# EAGLE schematic Nixie (EAGLE 6.3)
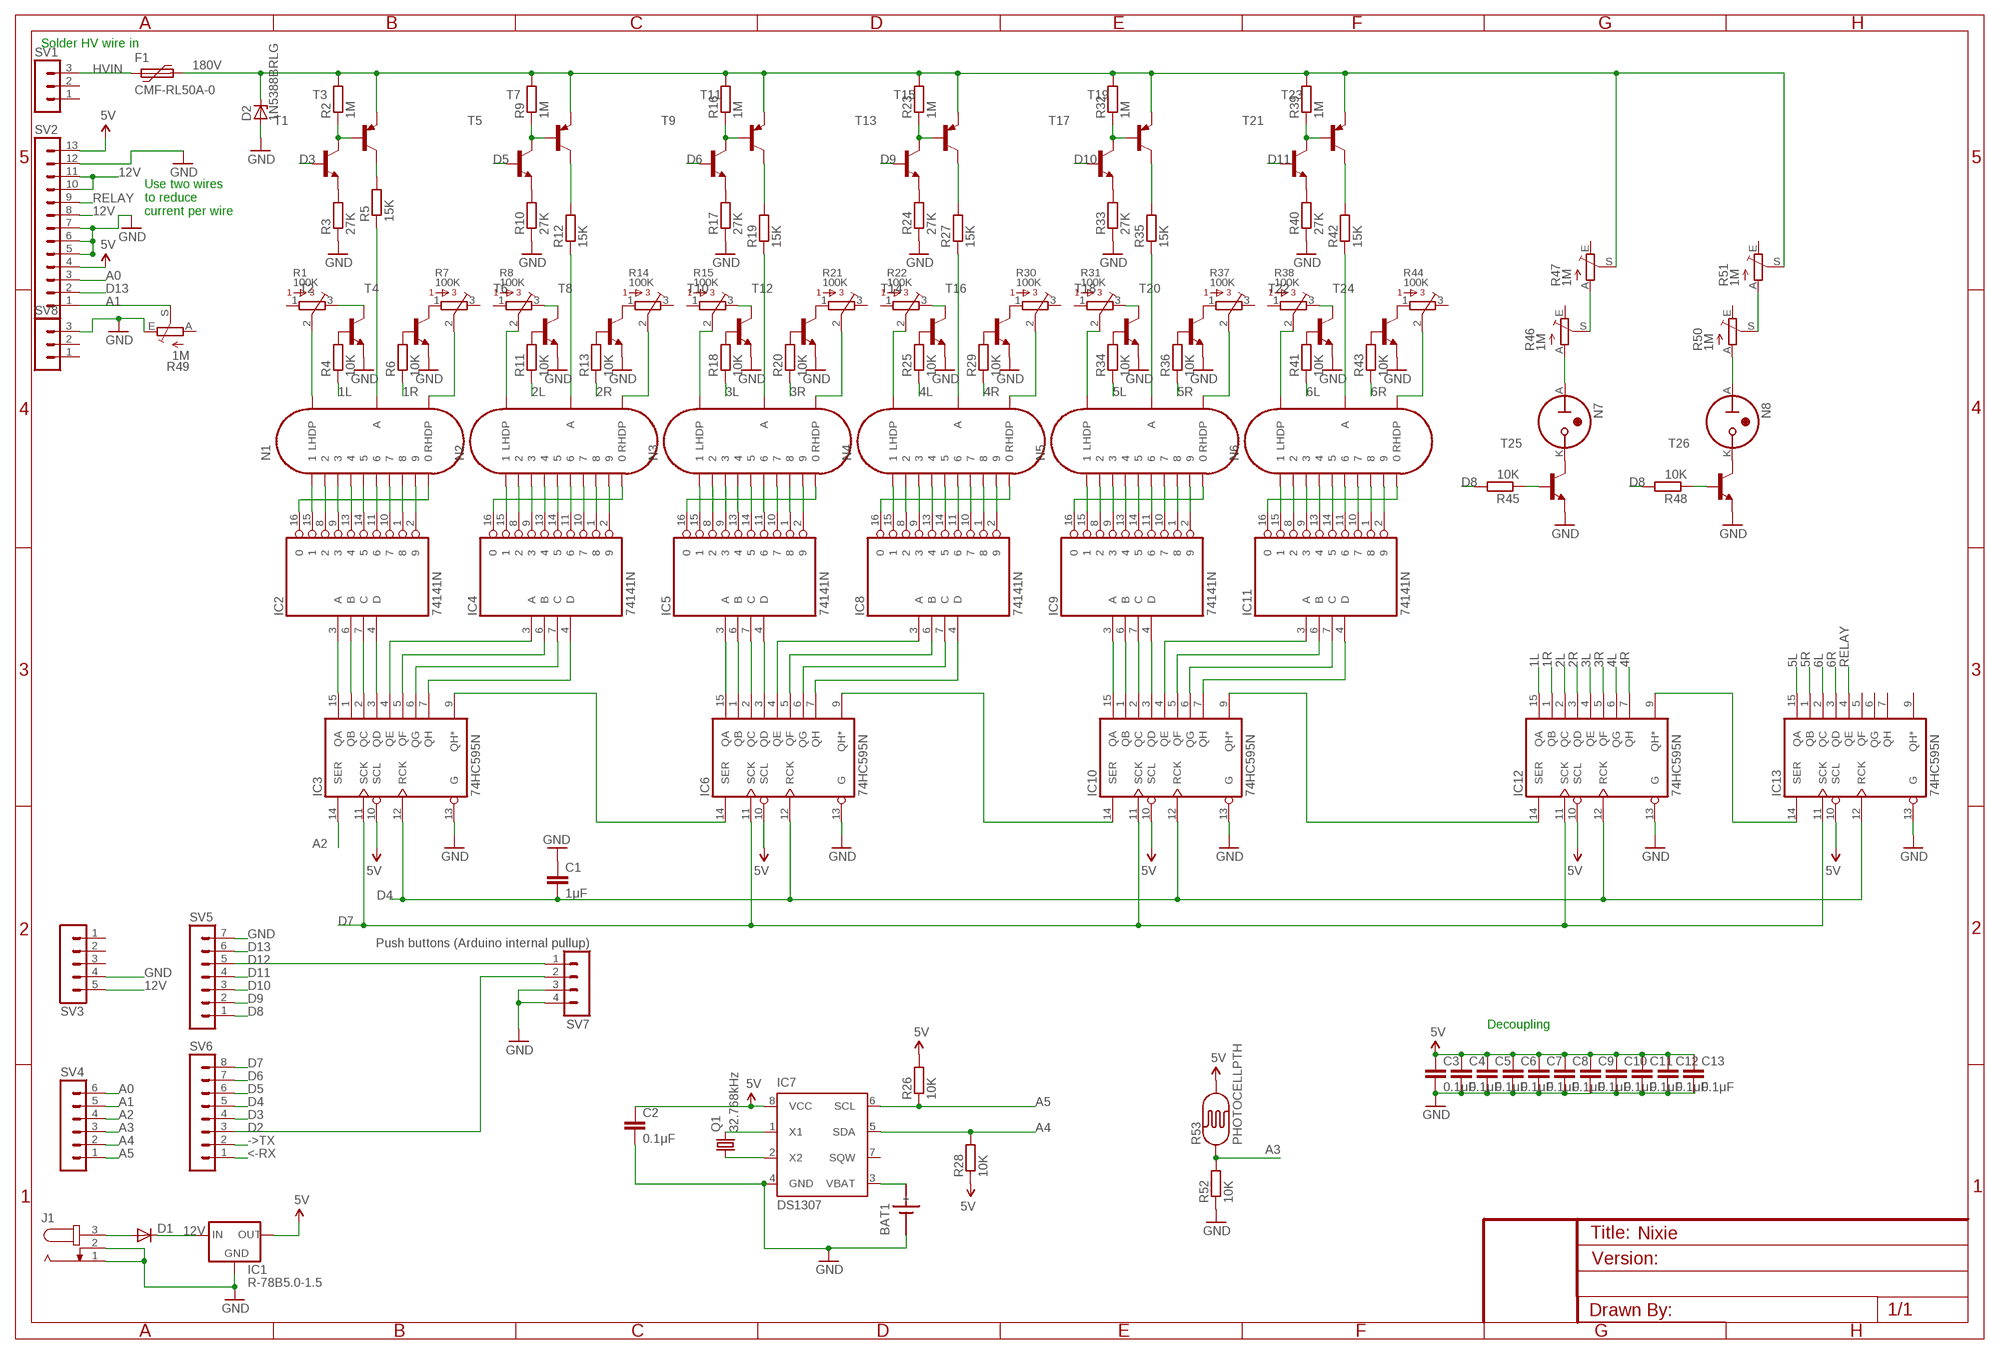
[diagram p0: schematic, sheet 1]

## Parts
BAT1  SN2032  [SN2032]
C1  1μF  C2.5/2  [C2.5-2]
C2  0.1μF  C2.5/2  [C2.5-2]
C3  0.1μF  C2.5/2  [C2.5-2]
C4  0.1μF  C2.5/2  [C2.5-2]
C5  0.1μF  C2.5/2  [C2.5-2]
C6  0.1μF  C2.5/2  [C2.5-2]
C7  0.1μF  C2.5/2  [C2.5-2]
C8  0.1μF  C2.5/2  [C2.5-2]
C9  0.1μF  C2.5/2  [C2.5-2]
C10  0.1μF  C2.5/2  [C2.5-2]
C11  0.1μF  C2.5/2  [C2.5-2]
C12  0.1μF  C2.5/2  [C2.5-2]
C13  0.1μF  C2.5/2  [C2.5-2]
D1  1N5400  [DO201-15]
D2  1N5388BRLG  1N5333  [C1702-15]
F1  CMF-RL50A-0  MF-R055-5,1  [MF-5,1]
IC1  R-78B5.0-1.5  [SIP3V]
IC2  74141N  [DIL16]
IC3  74HC595N  [DIL16]
IC4  74141N  [DIL16]
IC5  74141N  [DIL16]
IC6  74HC595N  [DIL16]
IC7  DS1307  [DIL08]
IC8  74141N  [DIL16]
IC9  74141N  [DIL16]
IC10  74HC595N  [DIL16]
IC11  74141N  [DIL16]
IC12  74HC595N  [DIL16]
IC13  74HC595N  [DIL16]
J1  JACK-PLUG0  [SPC4077]
N1  IN-14  [IN-14]
N2  IN-14  [IN-14]
N3  IN-14  [IN-14]
N4  IN-14  [IN-14]
N5  IN-14  [IN-14]
N6  IN-14  [IN-14]
N7  IN-3  [IN-3]
N8  IN-3  [IN-3]
Q1  32.768kHz  CRYSTALTC26V  [TC26V]
R1  100K  3362P  [3362P]
R2  1M  R-EU_0207/10  [0207/10]
R3  27K  R-EU_0207/10  [0207/10]
R4  10K  R-EU_0207/10  [0207/10]
R5  15K  R-EU_0207/10  [0207/10]
R6  10K  R-EU_0207/10  [0207/10]
R7  100K  3362P  [3362P]
R8  100K  3362P  [3362P]
R9  1M  R-EU_0207/10  [0207/10]
R10  27K  R-EU_0207/10  [0207/10]
R11  10K  R-EU_0207/10  [0207/10]
R12  15K  R-EU_0207/10  [0207/10]
R13  10K  R-EU_0207/10  [0207/10]
R14  100K  3362P  [3362P]
R15  100K  3362P  [3362P]
R16  1M  R-EU_0207/10  [0207/10]
R17  27K  R-EU_0207/10  [0207/10]
R18  10K  R-EU_0207/10  [0207/10]
R19  15K  R-EU_0207/10  [0207/10]
R20  10K  R-EU_0207/10  [0207/10]
R21  100K  3362P  [3362P]
R22  100K  3362P  [3362P]
R23  1M  R-EU_0207/10  [0207/10]
R24  27K  R-EU_0207/10  [0207/10]
R25  10K  R-EU_0207/10  [0207/10]
R26  10K  R-EU_0207/10  [0207/10]
R27  15K  R-EU_0207/10  [0207/10]
R28  10K  R-EU_0207/10  [0207/10]
R29  10K  R-EU_0207/10  [0207/10]
R30  100K  3362P  [3362P]
R31  100K  3362P  [3362P]
R32  1M  R-EU_0207/10  [0207/10]
R33  27K  R-EU_0207/10  [0207/10]
R34  10K  R-EU_0207/10  [0207/10]
R35  15K  R-EU_0207/10  [0207/10]
R36  10K  R-EU_0207/10  [0207/10]
R37  100K  3362P  [3362P]
R38  100K  3362P  [3362P]
R39  1M  R-EU_0207/10  [0207/10]
R40  27K  R-EU_0207/10  [0207/10]
R41  10K  R-EU_0207/10  [0207/10]
R42  15K  R-EU_0207/10  [0207/10]
R43  10K  R-EU_0207/10  [0207/10]
R44  100K  3362P  [3362P]
R45  10K  R-EU_0207/10  [0207/10]
R46  1M  TRIM_EU-ECP10S  [ECP10S]
R47  1M  TRIM_EU-ECP10S  [ECP10S]
R48  10K  R-EU_0207/10  [0207/10]
R49  1M  TRIM_EU-ECP10S  [ECP10S]
R50  1M  TRIM_EU-ECP10S  [ECP10S]
R51  1M  TRIM_EU-ECP10S  [ECP10S]
R52  10K  R-EU_0207/10  [0207/10]
R53  PHOTOCELLPTH  [PHOTOCELL]
SV1  MA03-1  [MA03-1]
SV2  MA13-1  [MA13-1]
SV3  MA05-1  [MA05-1]
SV4  MA06-1  [MA06-1]
SV5  MA07-1  [MA07-1]
SV6  MA08-1  [MA08-1]
SV7  Push buttons (Arduino internal pullup)  MA04-1  [MA04-1]
SV8  MA03-1  [MA03-1]
T1  MPSA42-NPN-TO92-CBE  [TO92-CBE]
T2  MPSA42-NPN-TO92-CBE  [TO92-CBE]
T3  BC327-16-PNP-TO92-EBC  [TO92-EBC]
T4  MPSA42-NPN-TO92-CBE  [TO92-CBE]
T5  MPSA42-NPN-TO92-CBE  [TO92-CBE]
T6  MPSA42-NPN-TO92-CBE  [TO92-CBE]
T7  BC327-16-PNP-TO92-EBC  [TO92-EBC]
T8  MPSA42-NPN-TO92-CBE  [TO92-CBE]
T9  MPSA42-NPN-TO92-CBE  [TO92-CBE]
T10  MPSA42-NPN-TO92-CBE  [TO92-CBE]
T11  BC327-16-PNP-TO92-EBC  [TO92-EBC]
T12  MPSA42-NPN-TO92-CBE  [TO92-CBE]
T13  MPSA42-NPN-TO92-CBE  [TO92-CBE]
T14  MPSA42-NPN-TO92-CBE  [TO92-CBE]
T15  BC327-16-PNP-TO92-EBC  [TO92-EBC]
T16  MPSA42-NPN-TO92-CBE  [TO92-CBE]
T17  MPSA42-NPN-TO92-CBE  [TO92-CBE]
T18  MPSA42-NPN-TO92-CBE  [TO92-CBE]
T19  BC327-16-PNP-TO92-EBC  [TO92-EBC]
T20  MPSA42-NPN-TO92-CBE  [TO92-CBE]
T21  MPSA42-NPN-TO92-CBE  [TO92-CBE]
T22  MPSA42-NPN-TO92-CBE  [TO92-CBE]
T23  BC327-16-PNP-TO92-EBC  [TO92-EBC]
T24  MPSA42-NPN-TO92-CBE  [TO92-CBE]
T25  MPSA42-NPN-TO92-CBE  [TO92-CBE]
T26  MPSA42-NPN-TO92-CBE  [TO92-CBE]

## Nets
1L: IC12.15(QA) R4.1
1R: IC12.1(QB) R6.1
2L: IC12.2(QC) R11.1
2R: IC12.3(QD) R13.1
3L: IC12.4(QE) R18.1
3R: IC12.5(QF) R20.1
4L: IC12.6(QG) R25.1
4R: IC12.7(QH) R29.1
5L: IC13.15(QA) R34.1
5R: IC13.1(QB) R36.1
6L: IC13.2(QC) R41.1
6R: IC13.3(QD) R43.1
12V: D1.C IC1.1(IN) SV2.8 SV2.10 SV2.11 SV3.5
180V: D2.C F1.2 R2.2 R9.2 R16.2 R23.2 R32.2 R39.2 R47.S R51.S T3.E T7.E T11.E T15.E T19.E T23.E
->TX: SV6.2
<-RX: SV6.1
A0: SV2.3 SV4.6
A1: R49.S SV2.1 SV4.5
A2: IC3.14(SER) SV4.4
A3: R52.2 R53.1 SV4.3
A4: IC7.5(SDA) R28.2 SV4.2
A5: IC7.6(SCL) R26.1 SV4.1
D2: SV6.3 SV7.2
D3: SV6.4 T1.B
D4: C1.2 IC3.12(RCK) IC6.12(RCK) IC10.12(RCK) IC12.12(RCK) IC13.12(RCK) SV6.5
D5: SV6.6 T5.B
D6: SV6.7 T9.B
D7: IC3.11(SCK) IC6.11(SCK) IC10.11(SCK) IC12.11(SCK) IC13.11(SCK) SV6.8
D8: R45.2 R48.2 SV5.1
D9: SV5.2 T13.B
D10: SV5.3 T17.B
D11: SV5.4 T21.B
D12: SV5.5 SV7.1
D13: SV2.2 SV5.6
GND: BAT1.- C1.1 C2.2 C3.2 C4.2 C5.2 C6.2 C7.2 C8.2 C9.2 C10.2 C11.2 C12.2 C13.2 D2.A IC1.2(GND) IC3.13(G) IC6.13(G) IC7.4(GND) IC10.13(G) IC12.13(G) IC13.13(G) J1.1 J1.2 R3.1 R10.1 R17.1 R24.1 R33.1 R40.1 R49.E R52.1 SV2.5 SV2.6 SV2.7 SV2.12 SV3.4 SV5.7 SV7.3 SV7.4 SV8.3 T2.E T4.E T6.E T8.E T10.E T12.E T14.E T16.E T18.E T20.E T22.E T24.E T25.E T26.E
HVIN: F1.1 SV1.3
N$3: N1.RHDP R7.2
N$4: IC3.9(QH*) IC6.14(SER)
N$5: IC6.9(QH*) IC10.14(SER)
N$6: IC10.9(QH*) IC12.14(SER)
N$7: IC12.9(QH*) IC13.14(SER)
N$8: IC2.3(A) IC3.15(QA)
N$9: IC2.6(B) IC3.1(QB)
N$10: IC2.7(C) IC3.2(QC)
N$11: IC2.4(D) IC3.3(QD)
N$12: IC3.4(QE) IC4.3(A)
N$13: IC3.5(QF) IC4.6(B)
N$14: IC3.6(QG) IC4.7(C)
N$15: IC3.7(QH) IC4.4(D)
N$16: IC5.3(A) IC6.15(QA)
N$17: IC5.6(B) IC6.1(QB)
N$18: IC5.7(C) IC6.2(QC)
N$19: IC5.4(D) IC6.3(QD)
N$20: IC6.4(QE) IC8.3(A)
N$21: IC6.5(QF) IC8.6(B)
N$22: IC6.6(QG) IC8.7(C)
N$23: IC6.7(QH) IC8.4(D)
N$24: IC9.3(A) IC10.15(QA)
N$25: IC9.6(B) IC10.1(QB)
N$26: IC9.7(C) IC10.2(QC)
N$27: IC9.4(D) IC10.3(QD)
N$28: IC10.4(QE) IC11.3(A)
N$29: IC10.5(QF) IC11.6(B)
N$30: IC10.6(QG) IC11.7(C)
N$31: IC10.7(QH) IC11.4(D)
N$32: IC2.15 N1.1
N$33: IC2.8 N1.2
N$34: IC2.9 N1.3
N$35: IC2.13 N1.4
N$36: IC2.14 N1.5
N$37: IC2.11 N1.6
N$38: IC2.10 N1.7
N$39: IC2.1 N1.8
N$40: IC2.2 N1.9
N$41: IC2.16 N1.0
N$42: IC4.15 N2.1
N$43: IC4.8 N2.2
N$44: IC4.9 N2.3
N$45: IC4.13 N2.4
N$46: IC4.14 N2.5
N$47: IC4.11 N2.6
N$48: IC4.10 N2.7
N$49: IC4.1 N2.8
N$50: IC4.2 N2.9
N$51: IC4.16 N2.0
N$52: IC5.15 N3.1
N$53: IC5.8 N3.2
N$54: IC5.9 N3.3
N$55: IC5.13 N3.4
N$56: IC5.14 N3.5
N$57: IC5.11 N3.6
N$58: IC5.10 N3.7
N$59: IC5.1 N3.8
N$60: IC5.2 N3.9
N$61: IC5.16 N3.0
N$62: IC8.15 N4.1
N$63: IC8.8 N4.2
N$64: IC8.9 N4.3
N$65: IC8.13 N4.4
N$66: IC8.14 N4.5
N$67: IC8.11 N4.6
N$68: IC8.10 N4.7
N$69: IC8.1 N4.8
N$70: IC8.2 N4.9
N$71: IC8.16 N4.0
N$72: IC9.15 N5.1
N$73: IC9.8 N5.2
N$74: IC9.9 N5.3
N$75: IC9.13 N5.4
N$76: IC9.14 N5.5
N$77: IC9.11 N5.6
N$78: IC9.10 N5.7
N$79: IC9.1 N5.8
N$80: IC9.2 N5.9
N$81: IC9.16 N5.0
N$82: IC11.15 N6.1
N$83: IC11.8 N6.2
N$84: IC11.9 N6.3
N$85: IC11.13 N6.4
N$86: IC11.14 N6.5
N$87: IC11.11 N6.6
N$88: IC11.10 N6.7
N$89: IC11.1 N6.8
N$90: IC11.2 N6.9
N$91: IC11.16 N6.0
N$92: N1.A R5.1
N$93: N2.A R12.1
N$94: N3.A R19.1
N$95: N4.A R27.1
N$96: N5.A R35.1
N$97: N6.A R42.1
N$98: R2.1 T1.C T3.B
N$99: R5.2 T3.C
N$100: R3.2 T1.E
N$101: R9.1 T5.C T7.B
N$102: R12.2 T7.C
N$103: R10.2 T5.E
N$104: R16.1 T9.C T11.B
N$105: R19.2 T11.C
N$106: R17.2 T9.E
N$107: R23.1 T13.C T15.B
N$108: R27.2 T15.C
N$109: R24.2 T13.E
N$110: R32.1 T17.C T19.B
N$111: R35.2 T19.C
N$112: R33.2 T17.E
N$113: R39.1 T21.C T23.B
N$114: R42.2 T23.C
N$115: R40.2 T21.E
N$116: R6.2 T4.B
N$117: R4.2 T2.B
N$118: R11.2 T6.B
N$119: R13.2 T8.B
N$120: R18.2 T10.B
N$121: R20.2 T12.B
N$122: R25.2 T14.B
N$123: R29.2 T16.B
N$124: R34.2 T18.B
N$125: R36.2 T20.B
N$126: R41.2 T22.B
N$127: R43.2 T24.B
N$128: R1.3 T2.C
N$129: R7.1 T4.C
N$130: R8.3 T6.C
N$131: R14.1 T8.C
N$132: R21.1 T12.C
N$133: R30.1 T16.C
N$134: R37.1 T20.C
N$135: R44.1 T24.C
N$136: R15.3 T10.C
N$137: N3.LHDP R15.2
N$138: R22.3 T14.C
N$139: N4.LHDP R22.2
N$141: D1.A J1.3
N$142: IC7.1(X1) Q1.2
N$143: IC7.2(X2) Q1.1
N$144: BAT1.+ IC7.3(VBAT)
N$152: N1.LHDP R1.2
N$153: N2.RHDP R14.2
N$154: N3.RHDP R21.2
N$155: N4.RHDP R30.2
N$156: N5.RHDP R37.2
N$157: N6.RHDP R44.2
N$158: N2.LHDP R8.2
N$159: R31.3 T18.C
N$160: N5.LHDP R31.2
N$161: N6.LHDP R38.2
N$162: R38.3 T22.C
N$163: N7.A R46.A
N$164: N8.A R50.A
N$165: R46.S R47.A
N$166: R50.S R51.A
N$167: N7.K T25.C
N$168: N8.K T26.C
N$169: R45.1 T25.B
N$170: R48.1 T26.B
RELAY: IC13.4(QE) SV2.9
VCC: C2.1 C3.1 C4.1 C5.1 C6.1 C7.1 C8.1 C9.1 C10.1 C11.1 C12.1 C13.1 IC1.3(OUT) IC3.10(SCL) IC6.10(SCL) IC7.8(VCC) IC10.10(SCL) IC12.10(SCL) IC13.10(SCL) R26.2 R28.1 R53.2 SV2.4 SV2.13 ; supply symbol labelled 5V
Unconnected: IC7.7(SQW) IC13.5(QF) IC13.6(QG) IC13.7(QH) IC13.9(QH*) R1.1 R7.3 R8.1 R14.3 R15.1 R21.3 R22.1 R30.3 R31.1 R37.3 R38.1 R44.3 R46.E R47.E R49.A R50.E R51.E SV1.1 SV1.2 SV3.1 SV3.2 SV3.3 SV8.1 SV8.2

## Notes on the sheet
- Solder HV wire in
- Use two wires
  to reduce 
  current per wire
- Decoupling

## Power pins joined to a net without a drawn wire
GND: IC2.12(GND) IC3.8(GND) IC4.12(GND) IC5.12(GND) IC6.8(GND) IC8.12(GND) IC9.12(GND) IC10.8(GND) IC11.12(GND) IC12.8(GND) IC13.8(GND)
VCC: IC2.5(VCC) IC3.16(VCC) IC4.5(VCC) IC5.5(VCC) IC6.16(VCC) IC8.5(VCC) IC9.5(VCC) IC10.16(VCC) IC11.5(VCC) IC12.16(VCC) IC13.16(VCC)

## Library data of the parts
BAT1 = sn2032:SN2032: LI BATTERY
C1-C13 = capacitor-wima:C: CAPACITOR naming: grid - package width
D1 = diode:1N5400: DIODE standard rectifier, 3 A, 50 V (Motorola)
D2 = diode:1N5333: Z DIODE 3.3 V, 5W, 5 percent (Motorola)
F1 = bourns:MF-R055: MultiFuse Polyfuse Overcurrent Protectors
IC1 = r-78xx_10:R-78B*-1.5: Innoline R-78Bxx-1.5 Series Switching Regulators - 1.5A, High Efficiency Source: http://www.recom-international.com/pdf/Innoline/R-78HBxx-1.5_L.pdf <http://www.recom-international.com/pdf/Innoline/R-78Bxx-1.5_L.pdf>; MF: Recom; MPN: R-78B5.0-1.5; OC_FARNELL: 1793163; OC_NEWARK: 62X9484
IC2 IC4 IC5 IC8 IC9 IC11 = 74xx-eu:74*141: BCD to decimal DECODER/DRIVER
IC3 IC6 IC10 IC12 IC13 = 74xx-eu:74*595: 8-bit SHIFT REGISTER, output latch
IC7 = ds1307_pcf8583:DS1307: I2C-Bus CLOCK/CALENDAR
J1 = con-jack:JACK-PLUG: DC POWER JACK Power Jack, DC, Right Angle, Through Hole, Rated 5A at 16VDC, PC Terminals Distributor: Farnell (www.Farnell.de) Drawing: 84N1161.pdf / 84N1162.pdf Manufacturer: SPC Technology (www.spctechnology.com) Type: SPC4077 / SPC 4078; OC_FARNELL: unknown; OC_NEWARK: unknown
N1-N6 = russian-nixies-edited:IN-14: IN-14: medium numeric frontview nixie tube
N7 N8 = russian-nixies:IN-3: IN-3: nixie bulb
Q1 = crystal_modded:CRYSTAL: CRYSTAL; OC_FARNELL: unknown; OC_NEWARK: unknown
R1 R7 R8 R14 R15 R21 R22 R30 R31 R37 R38 R44 = bourns:3362: 3362 Series 1/4" Square Trimmer
R2-R6 R9-R13 R16-R20 R23-R29 R32-R36 R39-R43 R45 R48 R52 = resistor:R-EU_: RESISTOR, European symbol
R46 R47 R49-R51 = pot:TRIM_EU-: POTENTIOMETER
R53 = SparkFun-Sensors:PHOTOCELL: CdS photoresistor. This is a low cost way to detect light levels. Resistance decreases with more incoming light. SparkFun SKU: SEN-09088
SV1 SV8 = con-lstb:MA03-1: PIN HEADER; OC_FARNELL: unknown; OC_NEWARK: unknown
SV2 = con-lstb:MA13-1: PIN HEADER; OC_FARNELL: unknown; OC_NEWARK: unknown
SV3 = con-lstb:MA05-1: PIN HEADER; OC_FARNELL: unknown; OC_NEWARK: unknown
SV4 = con-lstb:MA06-1: PIN HEADER; OC_FARNELL: unknown; OC_NEWARK: unknown
SV5 = con-lstb:MA07-1: PIN HEADER; OC_FARNELL: unknown; OC_NEWARK: unknown
SV6 = con-lstb:MA08-1: PIN HEADER; OC_FARNELL: unknown; OC_NEWARK: unknown
SV7 = con-lstb:MA04-1: PIN HEADER; OC_FARNELL: unknown; OC_NEWARK: unknown
T1 T2 T4-T6 T8-T10 T12-T14 T16-T18 T20-T22 T24-T26 = transistor:*-NPN-: NPN Transistror BF959 corrected 2008.03.06
T3 T7 T11 T15 T19 T23 = transistor:*-PNP-: PNP Transistror